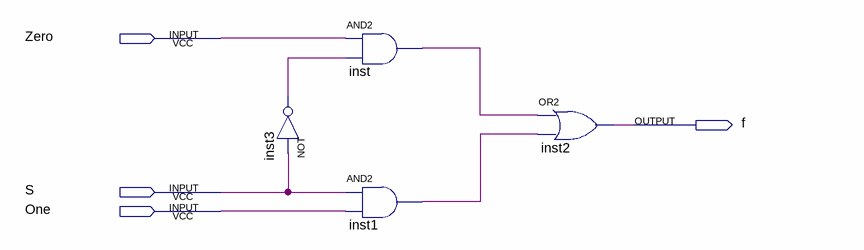
[diagram p0: schematic sheet]
// Quartus schematic TwotoOneMux.bdf as structural Verilog: 4 symbols, 4 pins
module TwotoOneMux (
  input  Zero,
  input  S,
  input  One,
  output f
);

  wire inst1_out, inst3_out, inst_out;

  not inst3 (inst3_out, S);
  and inst (inst_out, Zero, inst3_out);
  and inst1 (inst1_out, S, One);
  or inst2 (f, inst_out, inst1_out);
endmodule
